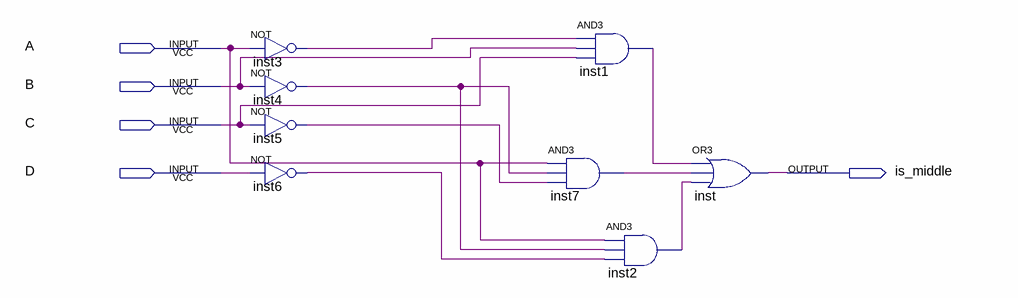
[diagram p0: schematic sheet]
// Quartus schematic middle_detector.bdf as structural Verilog: 8 symbols, 5 pins
module middle_detector (
  input  A,
  input  B,
  input  C,
  input  D,
  output is_middle
);

  wire inst1_out, inst2_out, inst3_out, inst4_out, inst5_out, inst6_out, inst7_out;

  not inst3 (inst3_out, A);
  not inst4 (inst4_out, B);
  not inst5 (inst5_out, C);
  not inst6 (inst6_out, D);
  and inst1 (inst1_out, inst3_out, B, C);
  and inst7 (inst7_out, A, inst4_out, inst5_out);
  and inst2 (inst2_out, A, inst4_out, inst6_out);
  or inst (is_middle, inst1_out, inst7_out, inst2_out);
endmodule
